# Altium schematic sheet WCH-CH9160-R0-1v0.SchDoc
size A4
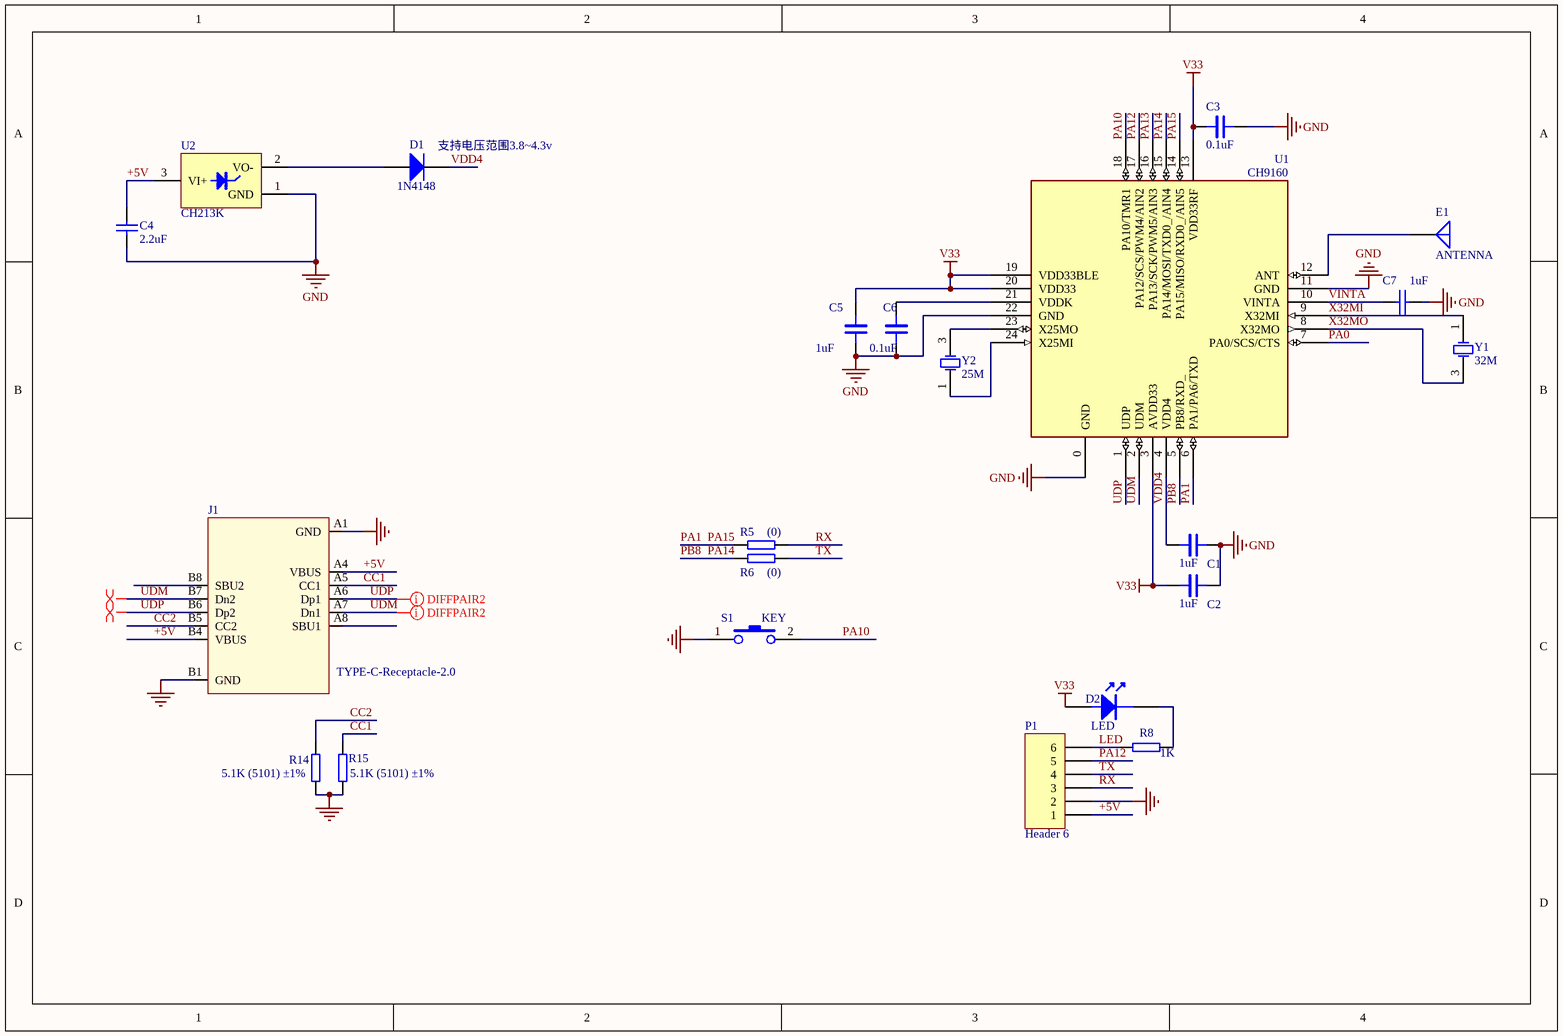
[diagram p0: WCH-CH9160-R0-1v0.SchDoc]

## Parts
C1  1uF  [0603_C]
C2  1uF  [0603_C]
C3  0.1uF  [0603_C]
C4  2.2uF  [0603_C]
C5  1uF  [0603_C]
C6  0.1uF  [0603_C]
C7  1uF  [0603_C]
D1  1N4148  [1206+]
D2  LED  [0603+]
E1  ANTENNA  [ANT-F-1-2.4G-1.6mmFR4]
J1  TYPE-C-Receptacle-2.0  [TYPE-C-Receptacle-2.0]
P1  Header 6  [SIP6-2.54mm]
R5  (0)  [0603]
R6  (0)  [0603]
R8  1K  [0603]
R14  5.1K (5101) ±1%  [0603]
R15  5.1K (5101) ±1%  [0603]
S1  KEY  [SMD_6.1x3.65x2.5mm-KEY]
U1  CH9160  [QFN24_4X4]
U2  CH213K  [SOT-23-3]
Y1  32M  [XT3225]
Y2  25M  [XT3225]

## Nets
GND: C1.1 C2.1 C3.2 C4.1 C5.2 C6.1 C7.1 J1.A1(GND) J1.B1(GND) P1.2 R14.2 R15.2 S1.1 U1.0(GND) U1.11(GND) U1.22(GND) U2.1(GND)
V33: C2.2 C3.1 C5.1 D2.1 U1.3(AVDD33) U1.13(VDD33RF) U1.19(VDD33BLE) U1.20(VDD33)
+5V: C4.2 J1.A4(VBUS) J1.B4(VBUS) P1.1 U2.3(VI+)
CC1: J1.A5(CC1) R15.1
CC2: J1.B5(CC2) R14.1
LED: P1.6 R8.1
PA0: U1.7(PA0/SCS/CTS)
PA1: R5.1 U1.6(PA1/PA6/TXD) U1.14(PA15/MISO/RXD0_/AIN5)  [also labelled PA15]
PA10: S1.2 U1.18(PA10/TMR1)
PA12: P1.5 U1.17(PA12/SCS/PWM4/AIN2)
PA13: U1.16(PA13/SCK/PWM5/AIN3)
PA14: R6.1 U1.5(PB8/RXD_) U1.15(PA14/MOSI/TXD0_/AIN4)  [also labelled PB8]
RX: P1.3 R5.2
TX: P1.4 R6.2
UDM: J1.A7(Dn1) J1.B7(Dn2) U1.2(UDM)
UDP: J1.A6(Dp1) J1.B6(Dp2) U1.1(UDP)
VDD4: C1.2 D1.2(K) U1.4(VDD4)
VINTA: C7.2 U1.10(VINTA)
X32MI: U1.9(X32MI) Y1.1(OSC1)
X32MO: U1.8(X32MO) Y1.3(OSC2)
NetC6_2: C6.2 U1.21(VDDK)
NetD1_1: D1.1(A) U2.2(VO-)
NetD2_2: D2.2 R8.2
NetE1_1: E1.1(A) U1.12(ANT)
NetU1_23: U1.23(X25MO) Y2.3(OSC2)
NetU1_24: U1.24(X25MI) Y2.1(OSC1)

Not connected (* = marked no-connect by the designer): J1 A8(SBU1) B8(SBU2)

## Layout directives
differential pair: UDM, UDP

## Notes on the sheet
- (near D1) 支持电压范围3.8~4.3v

## Library data of the parts
C1-C3 C5 C6 = CAP: Capacitor
C4 = Cap: Capacitor; Value: 100pF; Published: 8-Jun-2000; LatestRevisionDate: 17-Jul-2002; LatestRevisionNote: Re-released for DXP Platform.; PackageReference: RAD-0.3; Publisher: Altium Limited
C7 = C0402
D1 = Diode: Default Diode; Published: 8-Jun-2000; LatestRevisionDate: 17-Jul-2002; LatestRevisionNote: Re-released for DXP Platform.; PackageVersion: Sep-1996; PackageReference: SMC; Publisher: Altium Limited; PackageDescription: DO-214-AB/SMC; 2 C-Bend Leads; Body 7.9 x 5.9 mm, inc. leads (LxW); Code_JEDEC: DO-214-AB
E1 = ANTENNA: Generic Antenna
J1 = TYPE-C-Receptacle-2.0: Type-C USB2.0 母座
P1 = Header 6: Header, 6-Pin; LatestRevisionDate: 17-Jul-2002; LatestRevisionNote: Re-released for DXP Platform.; Publisher: Altium Limited
R5 R6 R8 R14 R15 = RES
S1 = KEY1
U1 = CH9160: BLE to USB2.0 high speed HID
U2 = CH213K: Ideal Diode 5V*1A
Y1 Y2 = XTAL: Crystal Oscillator; Published: 8-Jun-2000; LatestRevisionDate: 17-Jul-2002; LatestRevisionNote: Re-released for DXP Platform.; PackageReference: R38; Publisher: Altium Limited; PackageDescription: Crystal, Thru-Hole; 2 Leads; Body 3.1 x 8.2 mm (Dia.xH)